# EAGLE schematic tiny10_basic (EAGLE 7.2.0)
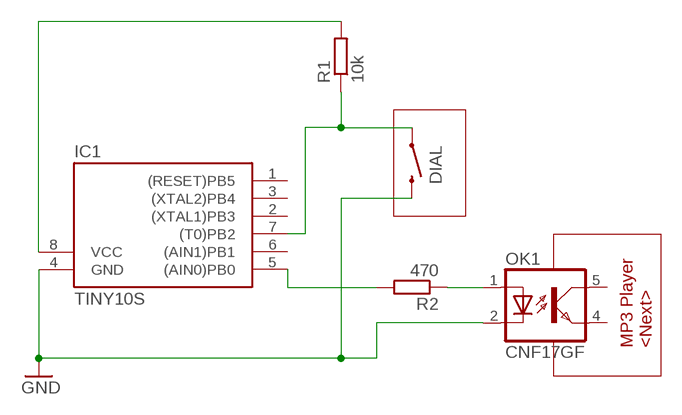
[diagram p0: schematic, sheet 1]

## Parts
DIAL  SWITCH-MOMENTARY-2PTH  [TACTILE-PTH]
IC1  TINY10S  [SOIC8]
OK1  CNF17GF  [DIL06B]
R1  10k  R-EU_0204/2V  [0204V]
R2  470  R-EU_0204/2V  [0204V]

## Nets
GND: DIAL.3 IC1.4(GND) OK1.2(C)
N$1: IC1.5((AIN0)PB0) R2.2
N$2: IC1.8(VCC) R1.2
N$3: DIAL.1 IC1.7((T0)PB2) R1.1
N$4: OK1.1(A) R2.1
Unconnected: IC1.1((RESET)PB5) IC1.2((XTAL1)PB3) IC1.3((XTAL2)PB4) IC1.6((AIN1)PB1) OK1.4(EMIT) OK1.5(COL)

## Notes on the sheet
- MP3 Player
  <Next>

## Library data of the parts
DIAL = SparkFun-Electromechanical:SWITCH-MOMENTARY-2: Various NO switches- pushbuttons, reed, etc; PROD_ID: SWCH-08441
IC1 = atmel:TINY10: MICROCONTROLLER 1 Kbytes ROM; OC_FARNELL: unknown; OC_NEWARK: unknown
OK1 = optocoupler:CNF17GF: HEWLETT PACKARD OPTO COUPLER; OC_FARNELL: unknown; OC_NEWARK: unknown
R1 R2 = resistor:R-EU_: RESISTOR, European symbol